# Altium project wisp-6-0.PrjPcb
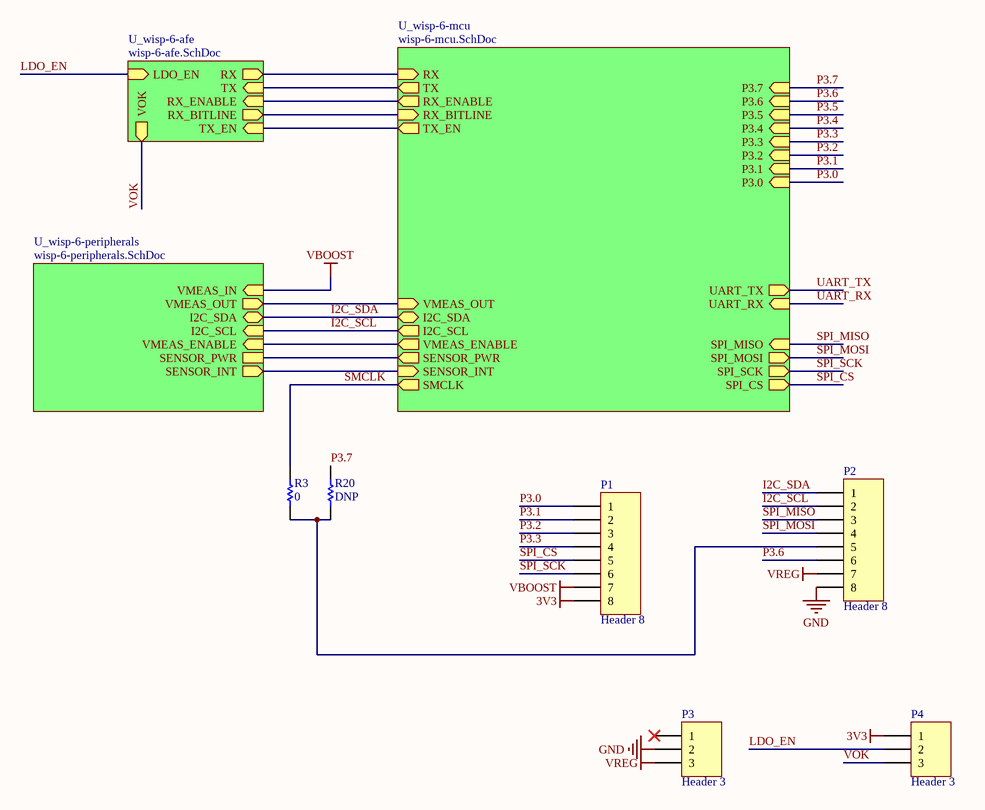
[diagram p0: wisp-6-main.SchDoc]
4 sheets, 77 parts. Net scope: hierarchical (ports join the sheet entries above them; power ports are global).
Board file: wisp-6-dipole.PcbDoc
Sheets:
  wisp-6-main.SchDoc
    U_wisp-6-mcu = wisp-6-mcu.SchDoc
    U_wisp-6-afe = wisp-6-afe.SchDoc
    U_wisp-6-peripherals = wisp-6-peripherals.SchDoc

## Sheet wisp-6-main.SchDoc: WISP-6.0
size B; SheetNumber: 1; SheetTotal: 4

### Parts
P1  Header 8  [HDR1X8]
P2  Header 8  [HDR1X8]
P3  Header 3  [HDR1X3]
P4  Header 3  [HDR1X3]
R3  value 0  [0402]  (hidden comment: Res)
R20  value DNP  [0402]  (hidden comment: Res)

### Sub-sheets
U_wisp-6-afe = wisp-6-afe.SchDoc: TX (in), RX_ENABLE (in), RX (out), RX_BITLINE (out), TX_EN (in), VOK (out), LDO_EN (in)
U_wisp-6-mcu = wisp-6-mcu.SchDoc: RX (in), TX (out), RX_ENABLE (out), VMEAS_ENABLE (out), I2C_SCL (out), I2C_SDA (bidir), VMEAS_OUT (in), P3.0 (in), P3.1 (in), P3.2 (in), P3.3 (in), P3.4 (in), P3.5 (in), P3.6 (in), P3.7 (in), SPI_CS (out), RX_BITLINE (in), UART_RX (in), UART_TX (out), SPI_SCK (out), SENSOR_PWR (out), SENSOR_INT (in), TX_EN (out), SMCLK (out), SPI_MISO (in), SPI_MOSI (out)
U_wisp-6-peripherals = wisp-6-peripherals.SchDoc: VMEAS_IN (in), VMEAS_OUT (out), VMEAS_ENABLE (in), I2C_SCL (in), I2C_SDA (bidir), SENSOR_INT (out), SENSOR_PWR

### Nets
3V3: P1.8 P4.1
GND: P2.8 P3.2
SENSOR_PWR: sheet U_wisp-6-mcu/SENSOR_PWR, sheet U_wisp-6-peripherals/SENSOR_PWR
VBOOST: P1.7 ; sheet U_wisp-6-peripherals/VMEAS_IN
VREG: P2.7 P3.3
BITLINE: sheet U_wisp-6-mcu/RX_BITLINE, sheet U_wisp-6-afe/RX_BITLINE
I2C_SCL: P2.2 ; sheet U_wisp-6-mcu/I2C_SCL, sheet U_wisp-6-peripherals/I2C_SCL
I2C_SDA: P2.1 ; sheet U_wisp-6-mcu/I2C_SDA, sheet U_wisp-6-peripherals/I2C_SDA
LDO_EN: P4.2 ; sheet U_wisp-6-afe/LDO_EN
P3.0: P1.1 ; sheet U_wisp-6-mcu/P3.0
P3.1: P1.2 ; sheet U_wisp-6-mcu/P3.1
P3.2: P1.3 ; sheet U_wisp-6-mcu/P3.2
P3.3: P1.4 ; sheet U_wisp-6-mcu/P3.3
P3.6: P2.6 ; sheet U_wisp-6-mcu/P3.6
P3.7: R20.2 ; sheet U_wisp-6-mcu/P3.7
RX: sheet U_wisp-6-mcu/RX, sheet U_wisp-6-afe/RX
SMCLK: R3.2 ; sheet U_wisp-6-mcu/SMCLK
SPI_CS: P1.5 ; sheet U_wisp-6-mcu/SPI_CS
SPI_MISO: P2.3 ; sheet U_wisp-6-mcu/SPI_MISO
SPI_MOSI: P2.4 ; sheet U_wisp-6-mcu/SPI_MOSI
SPI_SCK: P1.6 ; sheet U_wisp-6-mcu/SPI_SCK
VOK: P4.3 ; sheet U_wisp-6-afe/VOK  [project net V_BATOK_RF]
NetC11_1: sheet U_wisp-6-mcu/RX_ENABLE, sheet U_wisp-6-afe/RX_ENABLE
NetP2_5: P2.5 R3.1 R20.1
NetR24_2: sheet U_wisp-6-mcu/VMEAS_ENABLE, sheet U_wisp-6-peripherals/VMEAS_ENABLE
NetR25_1: sheet U_wisp-6-mcu/VMEAS_OUT, sheet U_wisp-6-peripherals/VMEAS_OUT
NetR27_2: sheet U_wisp-6-mcu/TX_EN, sheet U_wisp-6-afe/TX_EN
NetR28_2: sheet U_wisp-6-mcu/TX, sheet U_wisp-6-afe/TX
NetU4_16: sheet U_wisp-6-mcu/SENSOR_INT, sheet U_wisp-6-peripherals/SENSOR_INT

Not connected (* = marked no-connect by the designer): P3 1*

### Library data of the parts
P1 P2 = Header 8: Header, 8-Pin; LatestRevisionDate: 17-Jul-2002; LatestRevisionNote: Re-released for DXP Platform.; Publisher: Altium Limited
P3 P4 = Header 3: Header, 3-Pin; LatestRevisionDate: 17-Jul-2002; LatestRevisionNote: Re-released for DXP Platform.; Publisher: Altium Limited
R3 R20 = Res: Chip Resistor (Surface Mount); Manufacturer: Generic Chip Res (TBD); Manufacturer Part Number: *; Digi-Key Part Number: *; Rating: *; Note: *

## Sheet wisp-6-mcu.SchDoc: MCU
size B; SheetNumber: 2; SheetTotal: 4
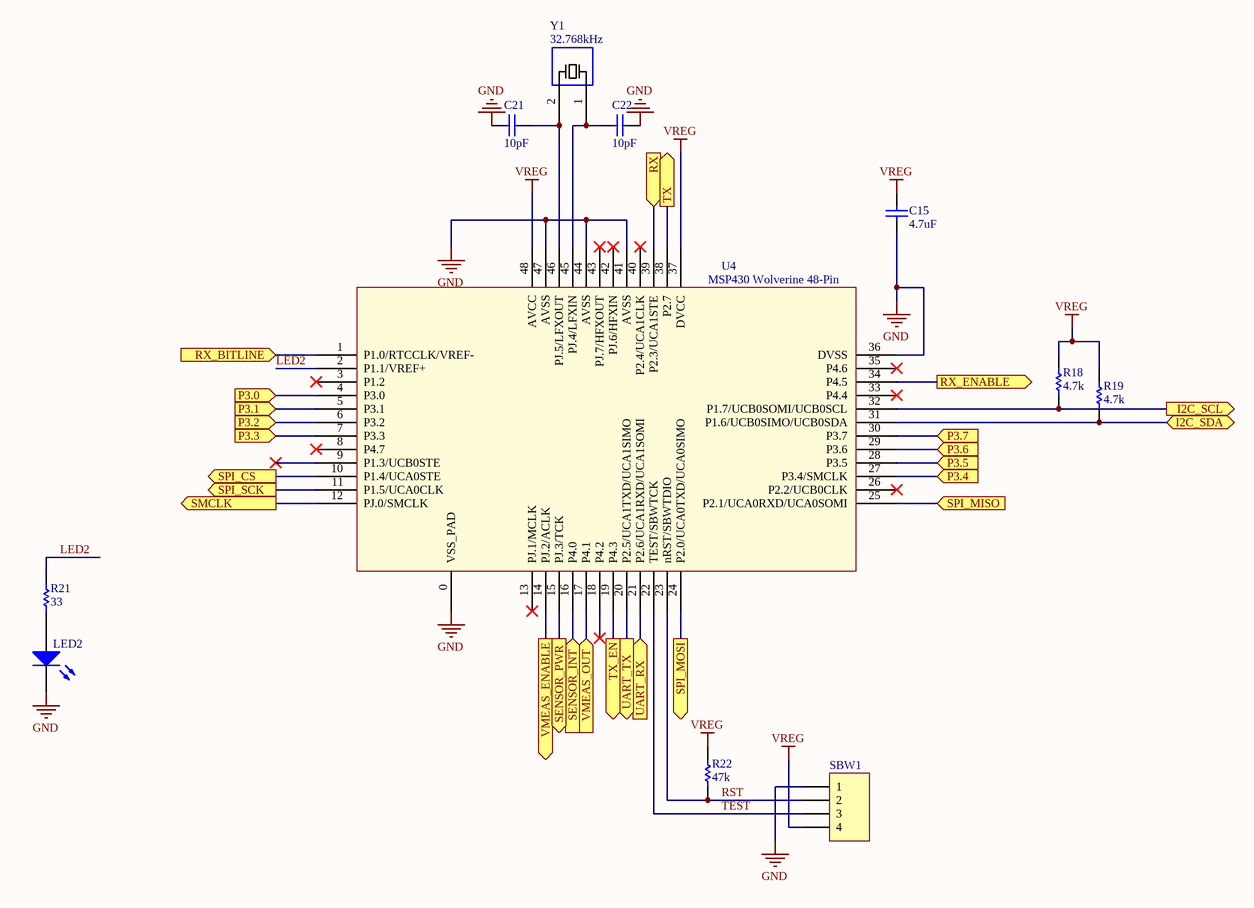
[diagram p1: wisp-6-mcu.SchDoc]

### Parts
C15  value 4.7uF  [0402]  (hidden comment: Cap)
C21  value 10pF  [0402]  (hidden comment: Cap)
C22  value 10pF  [0402]  (hidden comment: Cap)
LED2  LED  [Diode - 0603]  (value not drawn)
R18  value 4.7k  [0402]  (hidden comment: Res)
R19  value 4.7k  [0402]  (hidden comment: Res)
R21  value 33  [0402]  (hidden comment: Res)
R22  value 47k  [0402]  (hidden comment: Res)
SBW1  MHDR1X4  [MHDR1X4]  (value not drawn)
U4  MSP430 Wolverine 48-Pin  [MSP_QFN48_RGZ_PAD0]
Y1  value 32.768kHz  [XTAL [3.20mm x 1.50mm]]  (hidden comment: XTAL)

### Ports
I2C_SCL (out), I2C_SDA (bidir), P3.0 (in), P3.1 (in), P3.2 (in), P3.3 (in), P3.4 (in), P3.5 (in), P3.6 (in), P3.7 (in), RX (in), RX_BITLINE (in), RX_ENABLE (out), SENSOR_INT (in), SENSOR_PWR (out), SMCLK (out), SPI_CS (out), SPI_MISO (in), SPI_MOSI (out), SPI_SCK (out), TX (out), TX_EN (out), UART_RX (in), UART_TX (out), VMEAS_ENABLE (out), VMEAS_OUT (in)

### Nets
GND: C15.1 C21.1 C22.1 LED2.2(K) SBW1.1 U4.0(VSS_PAD) U4.36(DVSS) U4.41(AVSS) U4.44(AVSS) U4.47(AVSS)
SENSOR_PWR: U4.15(PJ.3/TCK) ; port SENSOR_PWR
VREG: C15.2 R18.2 R19.2 R22.2 SBW1.4 U4.37(DVCC) U4.48(AVCC)
BITLINE: U4.1(P1.0/RTCCLK/VREF-) ; port RX_BITLINE
I2C_SCL: R18.1 U4.32(P1.7/UCB0SOMI/UCB0SCL) ; port I2C_SCL
I2C_SDA: R19.1 U4.31(P1.6/UCB0SIMO/UCB0SDA) ; port I2C_SDA
LED2: R21.2 U4.2(P1.1/VREF+)
P3.0: U4.4(P3.0) ; port P3.0
P3.1: U4.5(P3.1) ; port P3.1
P3.2: U4.6(P3.2) ; port P3.2
P3.3: U4.7(P3.3) ; port P3.3
P3.4: U4.27(P3.4/SMCLK) ; port P3.4
P3.5: U4.28(P3.5) ; port P3.5
P3.6: U4.29(P3.6) ; port P3.6
P3.7: U4.30(P3.7) ; port P3.7
RST: R22.1 SBW1.2 U4.23(nRST/SBWTDIO)
RX: U4.39(P2.3/UCA1STE) ; port RX
SMCLK: U4.12(PJ.0/SMCLK) ; port SMCLK
SPI_CS: U4.10(P1.4/UCA0STE) ; port SPI_CS
SPI_MISO: U4.25(P2.1/UCA0RXD/UCA0SOMI) ; port SPI_MISO
SPI_MOSI: U4.24(P2.0/UCA0TXD/UCA0SIMO) ; port SPI_MOSI
SPI_SCK: U4.11(P1.5/UCA0CLK) ; port SPI_SCK
TEST: SBW1.3 U4.22(TEST/SBWTCK)
UART_RX: U4.21(P2.6/UCA1RXD/UCA1SOMI) ; port UART_RX
UART_TX: U4.20(P2.5/UCA1TXD/UCA1SIMO) ; port UART_TX
NetC11_1: U4.34(P4.5) ; port RX_ENABLE
NetC21_2: C21.2 U4.46(PJ.5/LFXOUT) Y1.2
NetC22_2: C22.2 U4.45(PJ.4/LFXIN) Y1.1
NetLED2_1: LED2.1(A) R21.1
NetR24_2: U4.14(PJ.2/ACLK) ; port VMEAS_ENABLE
NetR25_1: U4.17(P4.1) ; port VMEAS_OUT
NetR27_2: U4.19(P4.3) ; port TX_EN
NetR28_2: U4.38(P2.7) ; port TX
NetU4_16: U4.16(P4.0) ; port SENSOR_INT

Not connected (* = marked no-connect by the designer): U4 3(P1.2)* 8(P4.7)* 9(P1.3/UCB0STE)* 13(PJ.1/MCLK)* 18(P4.2)* 26(P2.2/UCB0CLK)* 33(P4.4)* 35(P4.6)* 40(P2.4/UCA1CLK)* 42(PJ.6/HFXIN)* 43(PJ.7/HFXOUT)*

### Library data of the parts
C15 C21 C22 = Cap: Ceramic Capacitor (Surface Mount); Manufacturer: Generic Ceramic Chip Cap (TBD); Digi-Key Part Number: *; Manufacturer Part Number: *; Note: *; Rating: *
LED2 = Diode - LED: Typical RED, GREEN, YELLOW, AMBER GaAs LED; Digi-Key Part Number: *; Manufacturer: *; Manufacturer Part Number: *; Note: *; Value: *; Rating: *
R18 R19 R21 R22 = Res: as R3 on sheet wisp-6-main; Manufacturer Part Number: *; Digi-Key Part Number: *; Rating: *
  R21 R22: Note: *
SBW1 = MHDR1X4: Header, 4-Pin; LatestRevisionDate: 17-Jul-2002; LatestRevisionNote: Re-released for DXP Platform.; Publisher: Altium Limited
U4 = MSP430FR596X_586X_RGZ: 16-bit FRAM MCU; Manufacture: Texas Instrument; PartNumber: MSP430FR5969; Datasheet Link: http://www.ti.com/lit/gpn/msp430fr5969
Y1 = XTAL 2-pins: Crystal Oscillator - [3.20mm x 1.50mm]; Manufacturer: Epson Toyocom Corporation; Manufacturer Part Number: FC-135 32.7680KA-A3; Digi-Key Part Number: example: SE2413CT-ND

## Sheet wisp-6-afe.SchDoc: AFE
size B; SheetNumber: 3; SheetTotal: 4
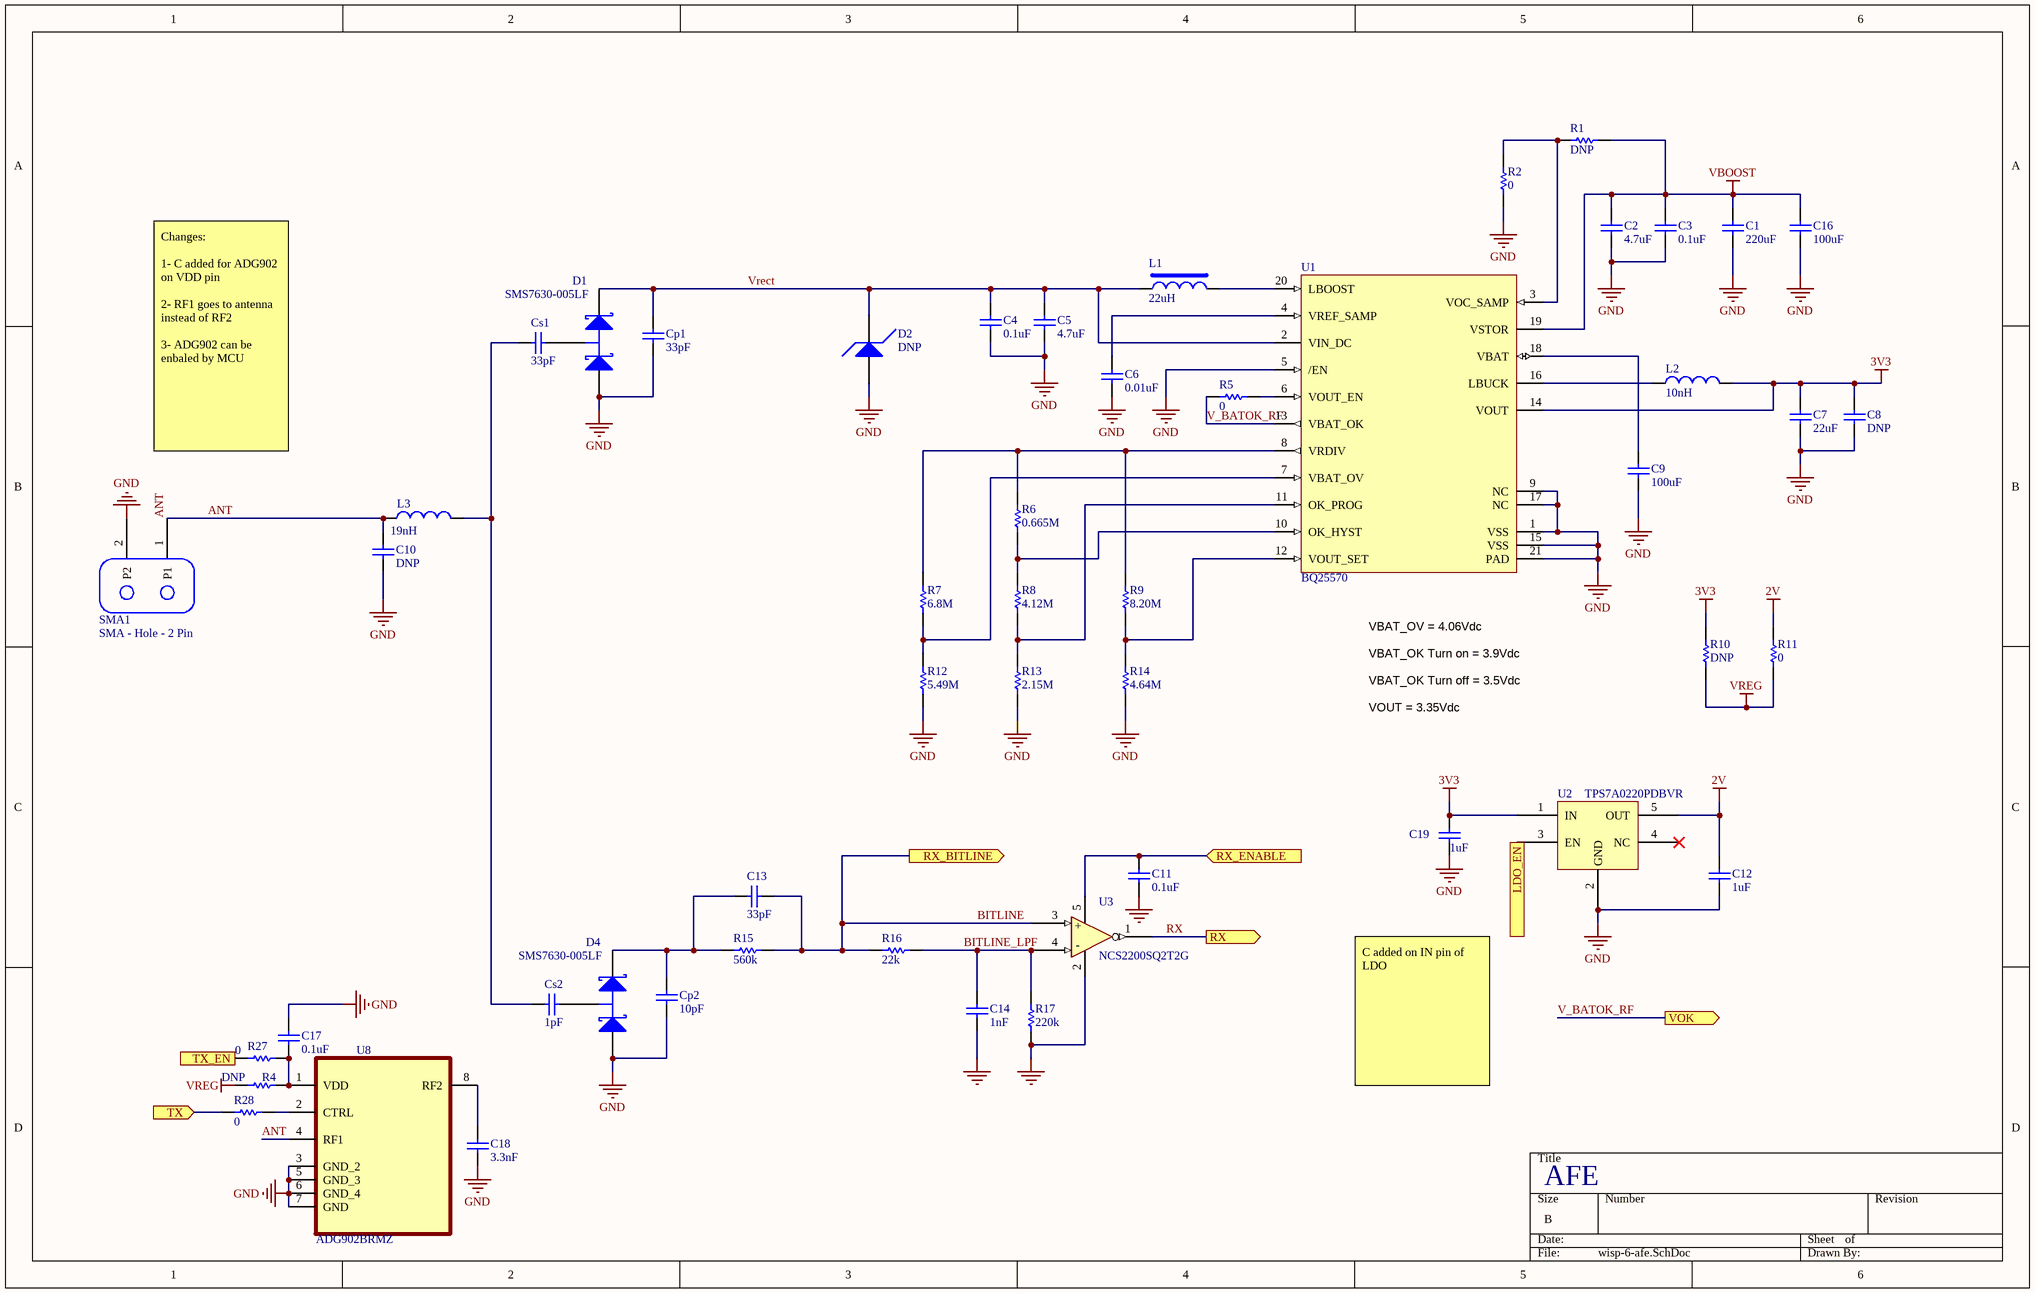
[diagram p2: wisp-6-afe.SchDoc]

### Parts
C1  value 220uF  [1206]  (hidden comment: Cap)
C2  value 4.7uF  [0402]  (hidden comment: Cap)
C3  value 0.1uF  [0402]  (hidden comment: Cap)
C4  value 0.1uF  [0402]  (hidden comment: Cap)
C5  value 4.7uF  [0402]  (hidden comment: Cap)
C6  value 0.01uF  [0402]  (hidden comment: Cap)
C7  value 22uF  [0402]  (hidden comment: Cout1)
C8  value DNP  [0402]  (hidden comment: Cout2)
C9  value 100uF  [0805]  (hidden comment: Cap)
C10  value DNP  [0402]  (hidden comment: Cap)
C11  value 0.1uF  [0402]  (hidden comment: Cap)
C12  value 1uF  [0402]  (hidden comment: Cap)
C13  value 33pF  [0402]  (hidden comment: Cap)
C14  value 1nF  [0402]  (hidden comment: Cap)
C16  value 100uF  [0805]  (hidden comment: Cap)
C17  value 0.1uF  [0402]  (hidden comment: Cap)
C18  value 3.3nF  [0402]  (hidden comment: Cap)
C19  value 1uF  [0402]  (hidden comment: Cap)
Cp1  value 33pF  [0402]  (hidden comment: Cap)
Cp2  value 10pF  [0402]  (hidden comment: Cap)
Cs1  value 33pF  [0402]  (hidden comment: Cap)
Cs2  value 1pF  [0402]  (hidden comment: Cap)
D1  SMS7630-005LF  [SOT23 - N]
D2  DNP  [Zener_SOD-523]
D4  SMS7630-005LF  [SOT23 - N]
L1  value 22uH  [LPS4018]  (hidden comment: Ind_LPS4018)
L2  value 10nH  [IND1008]  (hidden comment: Ind)
L3  value 19nH  [0603]  (hidden comment: Ind)
R1  value DNP  [0402]  (hidden comment: R_80%)
R2  value 0  [0402]  (hidden comment: R_50%)
R4  value DNP  [0402]  (hidden comment: Rok3)
R5  value 0  [0402]  (hidden comment: R_VBAT_OK)
R6  value 0.665M  [0402]  (hidden comment: Rok3)
R7  value 6.8M  [0402]  (hidden comment: Rov2)
R8  value 4.12M  [0402]  (hidden comment: Rok2)
R9  value 8.20M  [0402]  (hidden comment: 8.2M)
R10  value DNP  [0402]  (hidden comment: Res)
R11  value 0  [0402]  (hidden comment: Res)
R12  value 5.49M  [0402]  (hidden comment: Rov1)
R13  value 2.15M  [0402]  (hidden comment: Rok1)
R14  4.64M  [0402]
R15  value 560k  [0402]  (hidden comment: Res)
R16  value 22k  [0402]  (hidden comment: Res)
R17  value 220k  [0402]  (hidden comment: Res)
R27  value 0  [0402]  (hidden comment: Rok3)
R28  value 0  [0402]  (hidden comment: Rok3)
SMA1  SMA - Hole - 2 Pin  [SMA - Hole - 2 Pin]
U1  BQ25570  [BQ25570]
U2  TPS7A0220PDBVR  [SOT23-5]
U3  NCS2200SQ2T2G  [SC70-5]
U8  ADG902BRMZ  [SOP65P490X110-8N]

### Ports
LDO_EN (in), RX (out), RX_BITLINE (out), RX_ENABLE (in), TX (in), TX_EN (in), VOK (out)

### Nets
2V: C12.2 R11.1 U2.5(OUT)
3V3: C7.2 C8.2 C19.2 L2.2 R10.1 U1.14(VOUT) U2.1(IN)
GND: C1.1 C2.1 C3.1 C4.1 C5.1 C6.1 C7.1 C8.1 C9.1 C10.1 C11.2 C12.1 C14.2 C16.1 C17.1 C18.1 C19.1 Cp1.2 Cp2.2 D1.1(A) D2.1(A) D4.1(A) R2.1 R12.2 R13.2 R14.2 R17.2 SMA1.2(P2) U1.1(VSS) U1.5(/EN) U1.9(NC) U1.15(VSS) U1.17(NC) U1.21(PAD) U2.2(GND) U3.2(Gnd) U8.3(GND_2) U8.5(GND_3) U8.6(GND_4) U8.7(GND)
VBOOST: C1.2 C2.2 C3.2 C16.2 R1.2 U1.19(VSTOR)
VREG: R4.2 R10.2 R11.2
ANT: C10.2 L3.1 SMA1.1(P1) U8.4(RF1)
BITLINE: C13.2 R15.1 R16.2 U3.3(IN+) ; port RX_BITLINE
BITLINE_LPF: C14.1 R16.1 R17.1 U3.4(In-)
LDO_EN: U2.3(EN) ; port LDO_EN
RX: U3.1(OUT) ; port RX
V_BATOK_RF: R5.1 U1.13(VBAT_OK) ; port VOK
Vrect: C4.2 C5.2 Cp1.1 D1.2(K) D2.2(K) L1.1 U1.2(VIN_DC)
NetC6_2: C6.2 U1.4(VREF_SAMP)
NetC9_2: C9.2 U1.18(VBAT)
NetC11_1: C11.1 U3.5(VDD) ; port RX_ENABLE
NetC13_1: C13.1 Cp2.1 D4.2(K) R15.2
NetC17_2: C17.2 R4.1 R27.1 U8.1(VDD)
NetC18_2: C18.2 U8.8(RF2)
NetCs1_1: Cs1.1 Cs2.1 L3.2
NetCs1_2: Cs1.2 D1.3(C)
NetCs2_2: Cs2.2 D4.3(C)
NetL1_2: L1.2 U1.20(LBOOST)
NetL2_1: L2.1 U1.16(LBUCK)
NetR1_1: R1.1 R2.2 U1.3(VOC_SAMP)
NetR5_2: R5.2 U1.6(VOUT_EN)
NetR6_1: R6.1 R7.1 R9.1 U1.8(VRDIV)
NetR6_2: R6.2 R8.1 U1.10(OK_HYST)
NetR7_2: R7.2 R12.1 U1.7(VBAT_OV)
NetR8_2: R8.2 R13.1 U1.11(OK_PROG)
NetR9_2: R9.2 R14.1 U1.12(VOUT_SET)
NetR27_2: R27.2 ; port TX_EN
NetR28_1: R28.1 U8.2(CTRL)
NetR28_2: R28.2 ; port TX

Not connected (* = marked no-connect by the designer): U2 4(NC)*

### Notes on the sheet
- Changes:
  1- C added for ADG902 on VDD pin
  2- RF1 goes to antenna instead of RF2
  3- ADG902 can be enbaled by MCU
- VBAT_OV = 4.06Vdc
- VBAT_OK Turn on = 3.9Vdc
- VBAT_OK Turn off = 3.5Vdc
- VOUT = 3.35Vdc
- C added on IN pin of LDO
- (in symbol NCS2200) +; -

### Library data of the parts
C1-C14 C16-C19 Cp1 Cp2 Cs1 Cs2 = Cap: as C15 on sheet wisp-6-mcu; Digi-Key Part Number: *; Manufacturer Part Number: *; Note: *; Rating: *
  C7 C8: Comment_1: Cap
D1 D4 = SMS7630-005LF: Schottky Diodes & Rectifiers Ls=1.5nH SOT-23 Series Pair
D2 = Zener_SOD-523: Diode - Zener; Manufacturer Part Number: *; Manufacturer: *; Digi-Key Part Number: *; Note: *
L1 = Ind_LPS4018: Inductor (Surface Mount); Manufacturer: Coil Craft; Digi-Key Part Number: *; Manufacturer Part Number: *; Rating: *; Note: *
L2 L3 = Ind: Inductor (Surface Mount); Digi-Key Part Number: *; Manufacturer: *; Manufacturer Part Number: *; Rating: *; Note: *
R1 R2 R4-R17 R27 R28 = Res: as R3 on sheet wisp-6-main; Manufacturer Part Number: *; Digi-Key Part Number: *; Rating: *
  R1 R2 R4-R9 R12 R13 R27 R28: Comment_1: Res
  R14: Value: 4.64M; Comment_1: Res
  R15-R17: Note: *
SMA1 = SMA - Hole - 2 Pin: Two pin SMA connector wisp; Note: This part is used to attach the antennae to WISP in the layout
U1 = BQ25570: Boost Charger; Manufacturer: Texas Instruments; Digi-Key Part Number: 296-37014-1-ND; Manufacturer Part Number: bq25570; Rating: *; Value: *; Note: *
U2 = TPS7A0218PDBVR: IC REG LINEAR 2V 200MA SOT23-5
U3 = NCS2200: Comparator General Purpose Open Drain SC-70-5; Manufacturer: ON Semiconductor; Digi-Key Part Number: NCS2200SQ2T2GOSTR-ND; Manufacturer Part Number: NCS2200SQ2T2G; Rating: *; Value: *; Note: *
U8 = ADG902BRMZ: RF Switch IC General Purpose SPST 2.5GHz 50Ohm 8-MSOP; MF: Analog Devices; Digi-Key_Part_Number: ADG902BRMZ-ND; MP: ADG902BRMZ; Purchase-URL: https://pricing.snapeda.com/search/part/ADG902BRMZ/?ref=eda; Value: *; SnapEDA_Link: https://www.snapeda.com/parts/ADG902BRMZ/Analog%20Devices%20Inc./view-part/233734/?ref=snap; Check_prices: https://www.snapeda.com/parts/ADG902BRMZ/Analog%20Devices%20Inc./view-part/233734/?ref=eda; Package: MSOP-8 Analog Devices

## Sheet wisp-6-peripherals.SchDoc: Peripherals
size B; SheetNumber: 4; SheetTotal: 4
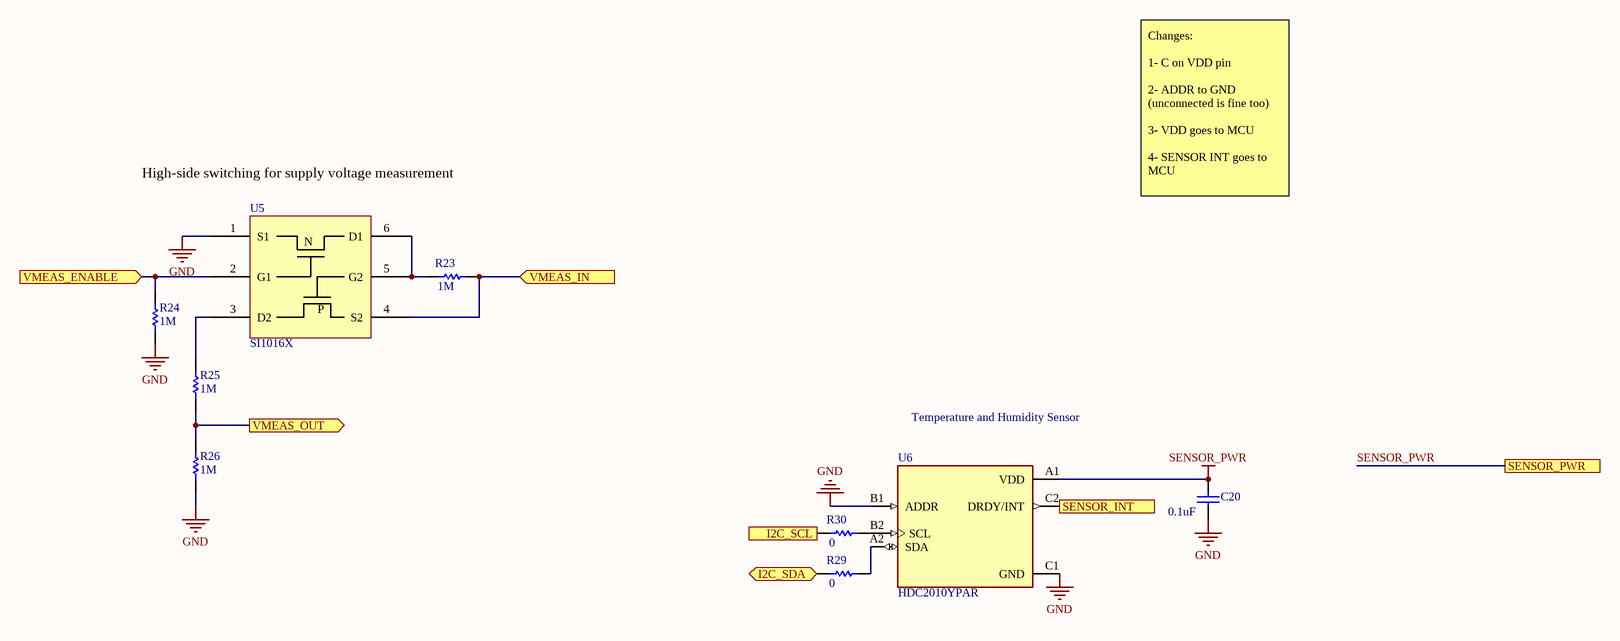
[diagram p3: wisp-6-peripherals.SchDoc]

### Parts
C20  value 0.1uF  [0402]  (hidden comment: Cap)
R23  value 1M  [0402]  (hidden comment: Res)
R24  value 1M  [0402]  (hidden comment: Res)
R25  value 1M  [0402]  (hidden comment: Res)
R26  value 1M  [0402]  (hidden comment: Res)
R29  value 0  [0402]  (hidden comment: Res)
R30  value 0  [0402]  (hidden comment: Res)
U5  SI1016X  [SC-89-6 Vishay]
U6  HDC2010YPAR  [BGA6C100X50P2X3_HDC2010YPAR]

### Ports
I2C_SCL (in), I2C_SDA (bidir), SENSOR_INT (out), SENSOR_PWR, VMEAS_ENABLE (in), VMEAS_IN (in), VMEAS_OUT (out)

### Nets
GND: C20.1 R24.1 R26.1 U5.1(S1) U6.B1(ADDR) U6.C1(GND)
SENSOR_PWR: C20.2 U6.A1(VDD) ; port SENSOR_PWR
VBOOST: R23.1 U5.4(S2) ; port VMEAS_IN
I2C_SCL: R30.2 ; port I2C_SCL
I2C_SDA: R29.2 ; port I2C_SDA
NetR23_2: R23.2 U5.5(G2) U5.6(D1)
NetR24_2: R24.2 U5.2(G1) ; port VMEAS_ENABLE
NetR25_1: R25.1 R26.2 ; port VMEAS_OUT
NetR25_2: R25.2 U5.3(D2)
NetR29_1: R29.1 U6.A2(SDA)
NetR30_1: R30.1 U6.B2(SCL)
NetU4_16: U6.C2(DRDY/INT) ; port SENSOR_INT

### Notes on the sheet
- High-side switching for supply voltage measurement
- Changes:
  1- C on VDD pin
  2- ADDR to GND (unconnected is fine too)
  3- VDD goes to MCU
  4- SENSOR INT goes to MCU
- Temperature and Humidity Sensor
- (in symbol SI1016X) N; P

### Library data of the parts
C20 = Cap: as C15 on sheet wisp-6-mcu; Digi-Key Part Number: *; Manufacturer Part Number: *; Note: *; Rating: *
R23-R26 R29 R30 = Res: as R3 on sheet wisp-6-main; Manufacturer Part Number: *; Digi-Key Part Number: *; Rating: *
U5 = SI1016X: NMOS and PMOS array
U6 = HDC2010YPAR: Humidity Temperature Sensor 0 ~ 100% RH IÂ²C Â±2% 8s Surface Mount; MF: Texas Instruments; MP: HDC2010YPAR; SnapEDA_Link: https://www.snapeda.com/parts/HDC2010YPAR/Texas%20Instruments/view-part/1603012/?ref=snap; Digi-Key_Purchase_URL: https://www.digikey.in/product-detail/en/texas-instruments/HDC2010YPAR/296-47774-1-ND/8133123?utm_source=snapeda&utm_medium=aggregator&utm_campaign=symbol; Package: DSBGA-6 Texas Instruments; Value: *; Digi-Key_Part_Number: 296-47774-1-ND

## Nets that join several sheets
3V3: wisp-6-main (P1.8 P4.1), wisp-6-afe (7 pins)
GND: wisp-6-main (P2.8 P3.2), wisp-6-mcu (10 pins), wisp-6-afe (40 pins), wisp-6-peripherals (6 pins)
SENSOR_PWR: wisp-6-mcu (U4.15), wisp-6-peripherals (C20.2 U6.A1)
VBOOST: wisp-6-main (P1.7), wisp-6-afe (6 pins), wisp-6-peripherals (R23.1 U5.4)
VREG: wisp-6-main (P2.7 P3.3), wisp-6-mcu (7 pins), wisp-6-afe (R4.2 R10.2 R11.2)
BITLINE: wisp-6-mcu (U4.1), wisp-6-afe (C13.2 R15.1 R16.2 U3.3)
I2C_SCL: wisp-6-main (P2.2), wisp-6-mcu (R18.1 U4.32), wisp-6-peripherals (R30.2)
I2C_SDA: wisp-6-main (P2.1), wisp-6-mcu (R19.1 U4.31), wisp-6-peripherals (R29.2)
LDO_EN: wisp-6-main (P4.2), wisp-6-afe (U2.3)
NetC11_1: wisp-6-mcu (U4.34), wisp-6-afe (C11.1 U3.5)
NetR24_2: wisp-6-mcu (U4.14), wisp-6-peripherals (R24.2 U5.2)
NetR25_1: wisp-6-mcu (U4.17), wisp-6-peripherals (R25.1 R26.2)
NetR27_2: wisp-6-mcu (U4.19), wisp-6-afe (R27.2)
NetR28_2: wisp-6-mcu (U4.38), wisp-6-afe (R28.2)
NetU4_16: wisp-6-mcu (U4.16), wisp-6-peripherals (U6.C2)
P3.0: wisp-6-main (P1.1), wisp-6-mcu (U4.4)
P3.1: wisp-6-main (P1.2), wisp-6-mcu (U4.5)
P3.2: wisp-6-main (P1.3), wisp-6-mcu (U4.6)
P3.3: wisp-6-main (P1.4), wisp-6-mcu (U4.7)
P3.6: wisp-6-main (P2.6), wisp-6-mcu (U4.29)
P3.7: wisp-6-main (R20.2), wisp-6-mcu (U4.30)
RX: wisp-6-mcu (U4.39), wisp-6-afe (U3.1)
SMCLK: wisp-6-main (R3.2), wisp-6-mcu (U4.12)
SPI_CS: wisp-6-main (P1.5), wisp-6-mcu (U4.10)
SPI_MISO: wisp-6-main (P2.3), wisp-6-mcu (U4.25)
SPI_MOSI: wisp-6-main (P2.4), wisp-6-mcu (U4.24)
SPI_SCK: wisp-6-main (P1.6), wisp-6-mcu (U4.11)
V_BATOK_RF: wisp-6-main (P4.3), wisp-6-afe (R5.1 U1.13)